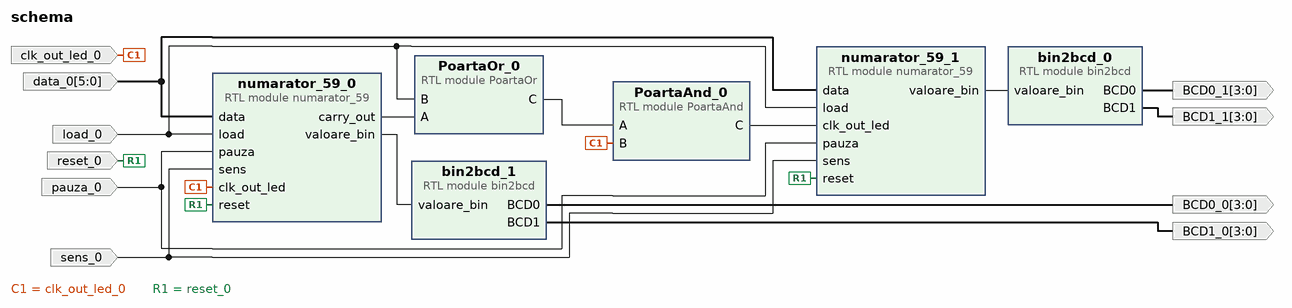
[diagram p0: block diagram of the top level]
# Vivado block design schema, xc7a100tcsg324-1, Vivado 2020.2
create_bd_design schema

create_bd_port -dir I clk_out_led_0
create_bd_port -dir I -from 5 -to 0 data_0
create_bd_port -dir I load_0
create_bd_port -dir I pauza_0
create_bd_port -dir I -type rst reset_0
create_bd_port -dir I sens_0
create_bd_port -dir O -from 3 -to 0 BCD0_0
create_bd_port -dir O -from 3 -to 0 BCD1_0
create_bd_port -dir O -from 3 -to 0 BCD1_1
create_bd_port -dir O -from 3 -to 0 BCD0_1

create_bd_cell -type module -reference numarator_59 numarator_59_0
create_bd_cell -type module -reference PoartaOr PoartaOr_0
create_bd_cell -type module -reference PoartaAnd PoartaAnd_0
create_bd_cell -type module -reference numarator_59 numarator_59_1
create_bd_cell -type module -reference bin2bcd bin2bcd_0
create_bd_cell -type module -reference bin2bcd bin2bcd_1

# ---- connections ----

connect_bd_net -net clk_out_led_0_1 [get_bd_ports clk_out_led_0] [get_bd_pins numarator_59_0/clk_out_led] [get_bd_pins PoartaAnd_0/B]
connect_bd_net -net data_0_1 [get_bd_ports data_0] [get_bd_pins numarator_59_0/data] [get_bd_pins numarator_59_1/data]
connect_bd_net -net load_0_1 [get_bd_ports load_0] [get_bd_pins numarator_59_0/load] [get_bd_pins numarator_59_1/load] [get_bd_pins PoartaOr_0/B]
connect_bd_net -net pauza_0_1 [get_bd_ports pauza_0] [get_bd_pins numarator_59_0/pauza] [get_bd_pins numarator_59_1/pauza]
connect_bd_net -net reset_0_1 [get_bd_ports reset_0] [get_bd_pins numarator_59_0/reset] [get_bd_pins numarator_59_1/reset]
connect_bd_net -net sens_0_1 [get_bd_ports sens_0] [get_bd_pins numarator_59_0/sens] [get_bd_pins numarator_59_1/sens]
connect_bd_net [get_bd_pins numarator_59_0/carry_out] [get_bd_pins PoartaOr_0/A]
connect_bd_net [get_bd_pins PoartaOr_0/C] [get_bd_pins PoartaAnd_0/A]
connect_bd_net [get_bd_pins PoartaAnd_0/C] [get_bd_pins numarator_59_1/clk_out_led]
connect_bd_net [get_bd_pins numarator_59_1/valoare_bin] [get_bd_pins bin2bcd_0/valoare_bin]
connect_bd_net [get_bd_pins numarator_59_0/valoare_bin] [get_bd_pins bin2bcd_1/valoare_bin]
connect_bd_net [get_bd_pins bin2bcd_1/BCD0] [get_bd_ports BCD0_0]
connect_bd_net [get_bd_pins bin2bcd_1/BCD1] [get_bd_ports BCD1_0]
connect_bd_net [get_bd_pins bin2bcd_0/BCD1] [get_bd_ports BCD1_1]
connect_bd_net [get_bd_pins bin2bcd_0/BCD0] [get_bd_ports BCD0_1]

validate_bd_design
save_bd_design
